# Altium schematic sheet SERIAL_FMU_REV_2A.SchDoc: Cube Yellow and Cube Orange
size A3; Date: 18/08/2014 1:53:13 PM; Author: PR; DrawnBy: Philip Rowse; Engineer: Philip Rowse; Organization: ProfiCNC/Hex; Address3: VIC; Address4: Australia; Revision: A; SheetNumber: 10; SheetTotal: 10
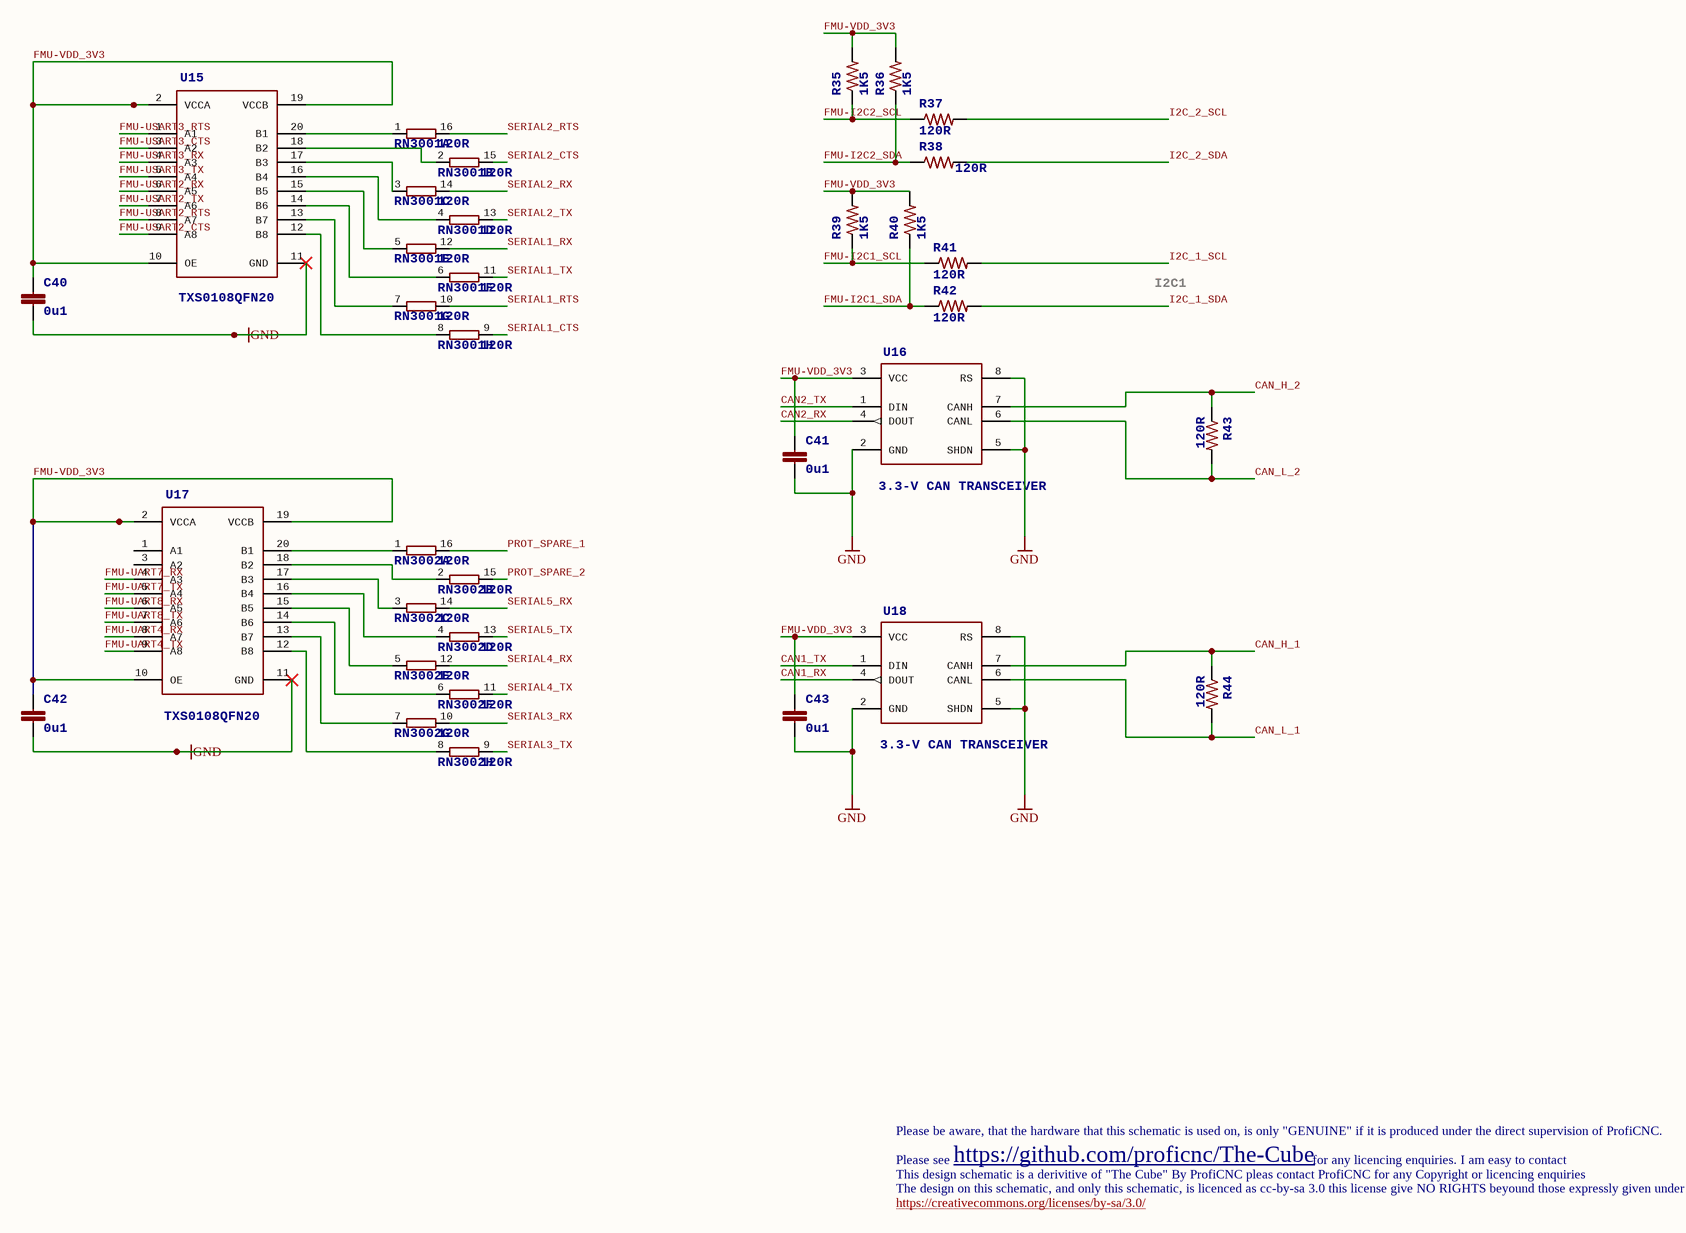
[diagram p0: SERIAL_FMU_REV_2A.SchDoc]

## Parts
C40  0u1  [0402-CAP]
C41  0u1  [0402-CAP]
C42  0u1  [0402-CAP]
C43  0u1  [0402-CAP]
R35  1K5  [0402-RES]
R36  1K5  [0402-RES]
R37  120R  [0402-RES]
R38  120R  [0402-RES]
R39  1K5  [0402-RES]
R40  1K5  [0402-RES]
R41  120R  [0402-RES]
R42  120R  [0402-RES]
R43  120R  [0402-RES]
R44  120R  [0402-RES]
RN3001  120R  [EXB2HV]  (parts A,B,C,D,E,F,G,H of 8)
RN3002  120R  [EXB2HV]  (parts A,B,C,D,E,F,G,H of 8)
U15  TXS0108QFN20  [QFN20-RGY]
U16  3.3-V CAN TRANSCEIVER  [SOT23-8]
U17  TXS0108QFN20  [QFN20-RGY]
U18  3.3-V CAN TRANSCEIVER  [SOT23-8]

## Nets
GND: C40.P$2 C41.P$2 C42.P$2 C43.P$2 U15.11(GND) U16.2(GND) U16.5(SHDN) U16.8(RS) U17.11(GND) U18.2(GND) U18.5(SHDN) U18.8(RS)
CAN1_RX: U18.4(DOUT)
CAN1_TX: U18.1(DIN)
CAN2_RX: U16.4(DOUT)
CAN2_TX: U16.1(DIN)
CAN_H_1: R44.P$1 U18.7(CANH)
CAN_H_2: R43.P$1 U16.7(CANH)
CAN_L_1: R44.P$2 U18.6(CANL)
CAN_L_2: R43.P$2 U16.6(CANL)
FMU-I2C1_SCL: R39.P$1 R41.P$1
FMU-I2C1_SDA: R40.P$1 R42.P$1
FMU-I2C2_SCL: R35.P$1 R37.P$1
FMU-I2C2_SDA: R36.P$1 R38.P$1
FMU-UART4_RX: U17.8(A7)
FMU-UART4_TX: U17.9(A8)
FMU-UART7_RX: U17.4(A3)
FMU-UART7_TX: U17.5(A4)
FMU-UART8_RX: U17.6(A5)
FMU-UART8_TX: U17.7(A6)
FMU-USART2_CTS: U15.9(A8)
FMU-USART2_RTS: U15.8(A7)
FMU-USART2_RX: U15.6(A5)
FMU-USART2_TX: U15.7(A6)
FMU-USART3_CTS: U15.3(A2)
FMU-USART3_RTS: U15.1(A1)
FMU-USART3_RX: U15.4(A3)
FMU-USART3_TX: U15.5(A4)
FMU-VDD_3V3: C40.P$1 C41.P$1 C42.P$1 C43.P$1 R35.P$2 R36.P$2 R39.P$2 R40.P$2 U15.2(VCCA) U15.10(OE) U15.19(VCCB) U16.3(VCC) U17.2(VCCA) U17.10(OE) U17.19(VCCB) U18.3(VCC)
I2C_1_SCL: R41.P$2
I2C_1_SDA: R42.P$2
I2C_2_SCL: R37.P$2
I2C_2_SDA: R38.P$2
PROT_SPARE_1: RN3002.16
PROT_SPARE_2: RN3002.15
SERIAL1_CTS: RN3001.9
SERIAL1_RTS: RN3001.10
SERIAL1_RX: RN3001.12
SERIAL1_TX: RN3001.11
SERIAL2_CTS: RN3001.15
SERIAL2_RTS: RN3001.16
SERIAL2_RX: RN3001.14
SERIAL2_TX: RN3001.13
SERIAL3_RX: RN3002.10
SERIAL3_TX: RN3002.9
SERIAL4_RX: RN3002.12
SERIAL4_TX: RN3002.11
SERIAL5_RX: RN3002.14
SERIAL5_TX: RN3002.13
NetRN3001_1: RN3001.1 U15.20(B1)
NetRN3001_2: RN3001.2 U15.18(B2)
NetRN3001_3: RN3001.3 U15.17(B3)
NetRN3001_4: RN3001.4 U15.16(B4)
NetRN3001_5: RN3001.5 U15.15(B5)
NetRN3001_6: RN3001.6 U15.14(B6)
NetRN3001_7: RN3001.7 U15.13(B7)
NetRN3001_8: RN3001.8 U15.12(B8)
NetRN3002_1: RN3002.1 U17.20(B1)
NetRN3002_2: RN3002.2 U17.18(B2)
NetRN3002_3: RN3002.3 U17.17(B3)
NetRN3002_4: RN3002.4 U17.16(B4)
NetRN3002_5: RN3002.5 U17.15(B5)
NetRN3002_6: RN3002.6 U17.14(B6)
NetRN3002_7: RN3002.7 U17.13(B7)
NetRN3002_8: RN3002.8 U17.12(B8)

Not connected (* = marked no-connect by the designer): U17 1(A1) 3(A2)

## Notes on the sheet
- I2C1
- Please be aware, that the hardware that this schematic is used on, is only "GENUINE" if it is produced under the direct supervision of ProfiCNC.
- The design on this schematic, and only this schematic, is licenced as cc-by-sa 3.0 this license give NO RIGHTS beyound those expressly given under the terms of this license.
- This design schematic is a derivitive of "The Cube" By ProfiCNC pleas contact ProfiCNC for any Copyright or licencing enquiries
- https://creativecommons.org/licenses/by-sa/3.0/
- Please see
- https://github.com/proficnc/The-Cube
- for any licencing enquiries. I am easy to contact
- Drawn By:
- Verified for production by:
- Approved for release:
- Title
- Size:
- Date:
- A
- Number:
- Time:
- Revision:
- Sheet
- of
- File:

## Library data of the parts
C40-C43 = CAP0402: CAP CER 0.1UF 16V Y5V 0402; Value: 0u1
R35 R36 R39 R40 = RESISTOR0402-RES: RES 1.5K OHM 1/16W 1% 0402 SMD; Value: 1K5
R37 R38 R41-R44 = RESISTOR0402-RES: RES 120 OHM 1/16W 1% 0402 SMD; Value: 120R
RN3001 RN3002 = 8R-NEXB2HV-120R: RES ARRAY 120 OHM 8 RES 1506; Value: 120R
U15 U17 = TXS0108QFN20: IC XLATR VOLT-LVL 8B BDIR 20QFN
U16 U18 = MAX3051MAX3051EKA: IC TXRX CAN 1MBPS SOT23-8; Value: CAN